# Altium schematic sheet MCU.SchDoc
size A3; DocumentNumber: 6; SheetNumber: 6; SheetTotal: 7
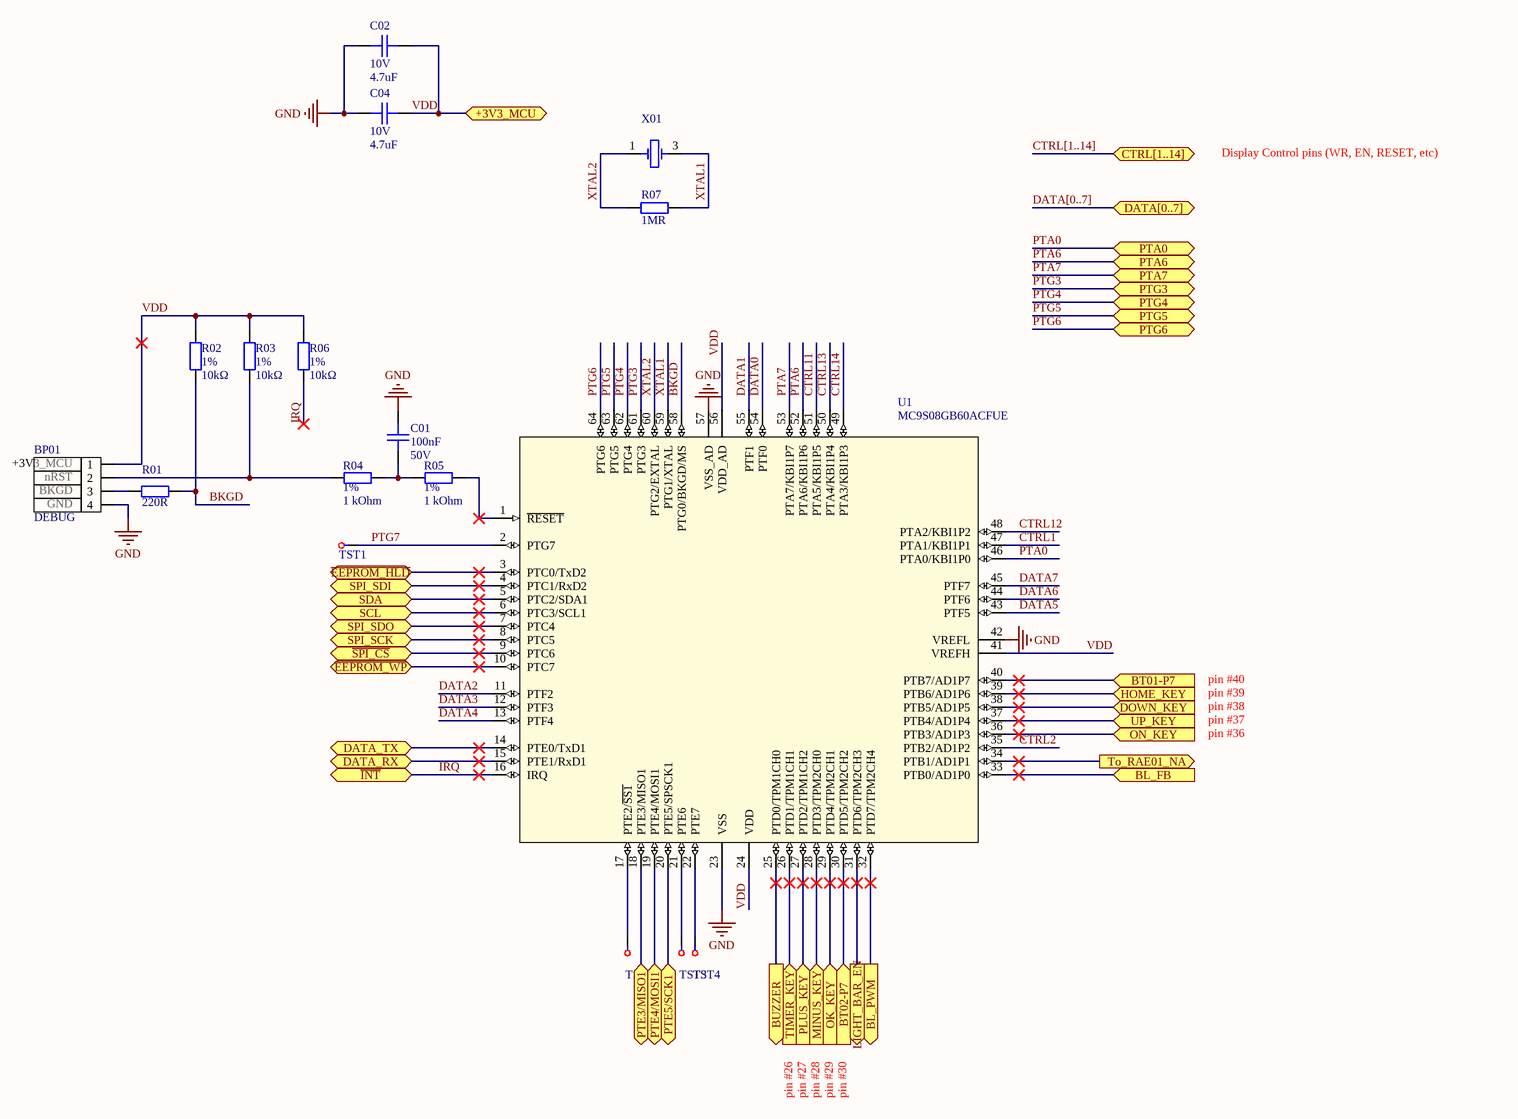
[diagram p0: MCU.SchDoc]

## Parts
BP01  DEBUG  pin_1: +3V3_MCU  pin_2: nRST  pin_3: BKGD  pin_4: GND
C01  Capacitance: 100nF  Voltage Rating: 50V  [CAPC1608X08N_0603]  (hidden comment: CAP CER 0.1uF ±10% 50V X7R 0603)
C02  Voltage Rating: 10V  Capacitance: 4.7uF  [0603C]  (hidden comment: CAP CER 4.7UF 10V X5R 0603)
C04  Voltage Rating: 10V  Capacitance: 4.7uF  [0603C]  (hidden comment: CAP CER 4.7UF 10V X5R 0603)
R01  Resistance: 220R  [Resistor-0603]  (hidden comment: R 220Ω ±1% 0603 0.1W)
R02  Tolerance: 1%  Resistance: 10kΩ  [R0603]  (hidden comment: 10 kOhms ±1% 0.1W, 1/10W Chip Resistor 0603 (1608 Metric)  Thick Film)
R03  Tolerance: 1%  Resistance: 10kΩ  [R0603]  (hidden comment: 10 kOhms ±1% 0.1W, 1/10W Chip Resistor 0603 (1608 Metric)  Thick Film)
R04  Tolerance: 1%  Resistance: 1 kOhm  [R0603]  (hidden comment: 1 kOhms ±1% 0.1W, 1/10W Chip Resistor 0603 (1608 Metric) Moisture Resistant Thick Film)  (no BOM)
R05  Tolerance: 1%  Resistance: 1 kOhm  [R0603]  (hidden comment: 1 kOhms ±1% 0.1W, 1/10W Chip Resistor 0603 (1608 Metric) Moisture Resistant Thick Film)  (no BOM)
R06  Tolerance: 1%  Resistance: 10kΩ  [R0603]  (hidden comment: 10 kOhms ±1% 0.1W, 1/10W Chip Resistor 0603 (1608 Metric)  Thick Film)
R07  Resistance: 1MR  [Resistor-0603]  (hidden comment: Resistor)
TST1  TestPoint  [Testpoint]  (value not drawn)  (no BOM)
TST2  TestPoint  [Testpoint]  (value not drawn)  (no BOM)
TST3  TestPoint  [Testpoint]  (value not drawn)  (no BOM)
TST4  TestPoint  [Testpoint]  (value not drawn)  (no BOM)
U1  MC9S08GB60ACFUE
X01  ABM11-16.000MHZ-D2X-T3  [ABM11]  (value not drawn)

## Ports
+3V3_MCU, BL_FB (in), BL_PWM (out), BT01-P7 (in), BT02-P7 (in), BUZZER (out), CTRL[1..14], DATA[0..7], DATA_RX, DATA_TX, DOWN_KEY (in), HOME_KEY (in), LIGHT_BAR_EN (out), MINUS_KEY (in), OK_KEY (in), ON_KEY (in), PLUS_KEY (in), PTA0 (bidir), PTA6 (bidir), PTA7 (bidir), PTE3/MISO1 (bidir), PTE4/MOSI1 (bidir), PTE5/SCK1 (bidir), PTG3 (bidir), PTG4 (bidir), PTG5 (bidir), PTG6 (bidir), SCL, SDA, SPI_SCK, SPI_SDI, SPI_SDO, TIMER_KEY (in), To_RAE01_NA (out), UP_KEY (in), ~{EEPROM_HLD}, ~{EEPROM_WP}, ~{INT}, ~{SPI_CS}

## Nets
D_GND: X01.2(GND) X01.4(GND)
GND: BP01.4 C01.2 C02.1 C04.1 U1.23(VSS) U1.42(VREFL) U1.57(VSS_AD)
~{EEPROM_HLD}: U1.3(PTC0/TxD2) ; port ~{EEPROM_HLD}
~{EEPROM_WP}: U1.10(PTC7) ; port ~{EEPROM_WP}
~{SPI_CS}: U1.9(PTC6) ; port ~{SPI_CS}
BKGD: R01.2 R02.1 U1.58(PTG0/BKGD/MS)
BL_FB: U1.33(PTB0/AD1P0) ; port BL_FB
BL_PWM: U1.32(PTD7/TPM2CH4) ; port BL_PWM
BT01-P7: U1.40(PTB7/AD1P7) ; port BT01-P7
BT02-P7: U1.30(PTD5/TPM2CH2) ; port BT02-P7
BUZZER: U1.25(PTD0/TPM1CH0) ; port BUZZER
CTRL1: U1.47(PTA1/KBI1P1)
CTRL2: U1.35(PTB2/AD1P2)
CTRL11: U1.51(PTA5/KBI1P5)
CTRL12: U1.48(PTA2/KBI1P2)
CTRL13: U1.50(PTA4/KBI1P4)
CTRL14: U1.49(PTA3/KBI1P3)
DATA0: U1.54(PTF0)
DATA1: U1.55(PTF1)
DATA2: U1.11(PTF2)
DATA3: U1.12(PTF3)
DATA4: U1.13(PTF4)
DATA5: U1.43(PTF5)
DATA6: U1.44(PTF6)
DATA7: U1.45(PTF7)
DATA_RX: U1.15(PTE1/RxD1) ; port DATA_RX
DATA_TX: U1.14(PTE0/TxD1) ; port DATA_TX
DOWN_KEY: U1.38(PTB5/AD1P5) ; port DOWN_KEY
HOME_KEY: U1.39(PTB6/AD1P6) ; port HOME_KEY
IRQ: R06.1 U1.16(IRQ) ; port ~{INT}
LIGHT_BAR_EN: U1.31(PTD6/TPM2CH3) ; port LIGHT_BAR_EN
MINUS_KEY: U1.28(PTD3/TPM2CH0) ; port MINUS_KEY
OK_KEY: U1.29(PTD4/TPM2CH1) ; port OK_KEY
ON_KEY: U1.36(PTB3/AD1P3) ; port ON_KEY
PLUS_KEY: U1.27(PTD2/TPM1CH2) ; port PLUS_KEY
PTA0: U1.46(PTA0/KBI1P0) ; port PTA0
PTA6: U1.52(PTA6/KBI1P6) ; port PTA6
PTA7: U1.53(PTA7/KBI1P7) ; port PTA7
PTE3/MISO1: U1.18(PTE3/MISO1) ; port PTE3/MISO1
PTE4/MOSI1: U1.19(PTE4/MOSI1) ; port PTE4/MOSI1
PTE5/SCK1: U1.20(PTE5/SPSCK1) ; port PTE5/SCK1
PTG3: U1.61(PTG3) ; port PTG3
PTG4: U1.62(PTG4) ; port PTG4
PTG5: U1.63(PTG5) ; port PTG5
PTG6: U1.64(PTG6) ; port PTG6
PTG7: TST1.1 U1.2(PTG7)
SCL: U1.6(PTC3/SCL1) ; port SCL
SDA: U1.5(PTC2/SDA1) ; port SDA
SPI_SCK: U1.8(PTC5) ; port SPI_SCK
SPI_SDI: U1.4(PTC1/RxD2) ; port SPI_SDI
SPI_SDO: U1.7(PTC4) ; port SPI_SDO
TIMER_KEY: U1.26(PTD1/TPM1CH1) ; port TIMER_KEY
To_RAE01_NA: U1.34(PTB1/AD1P1) ; port To_RAE01_NA
UP_KEY: U1.37(PTB4/AD1P4) ; port UP_KEY
VDD: BP01.1 C02.2 C04.2 R02.2 R03.2 R06.2 U1.24(VDD) U1.41(VREFH) U1.56(VDD_AD) ; port +3V3_MCU
XTAL1: R07.2 U1.59(PTG1/XTAL) X01.3(OSC2)
XTAL2: R07.1 U1.60(PTG2/EXTAL) X01.1(OSC1)
NetBP01_2: BP01.2 R03.1 R04.1
NetBP01_3: BP01.3 R01.1
NetC01_1: C01.1 R04.2 R05.1
NetR05_2: R05.2 U1.1(~{RESET})
NetTST2_1: TST2.1 U1.17(PTE2/~{SS1})
NetTST3_1: TST3.1 U1.21(PTE6)
NetTST4_1: TST4.1 U1.22(PTE7)

## Buses and harness runs
bus CTRL[1..14] = port CTRL[1..14]
bus DATA[0..7] = port DATA[0..7]

## Notes on the sheet
- Display Control pins (WR, EN, RESET, etc)
- pin #40
- pin #39
- pin #38
- pin #37
- pin #36
- pin #26
- pin #27
- pin #28
- pin #29
- pin #30
- Title
- Size:
- Date:
- A3
- Number:
- Time:
- Revision:
- Sheet
- of
- File:

## Library data of the parts
BP01 = CONN HEADER 4POS
C01 = CAP CER 0.1uF ±10% 50V X7R 0603: Capacitor; Manufacturer: KEMET; Manufacturer Part Number: C0603C104M5RACTU; Dielectric Material: Ceramic; Tolerance: 20%; Dissipation Factor: 2.5%; Supplier 1: Digi-Key; Stock 1: 1202175; Pricing 1: 1=0.1, 10=0.039, 50=0.0204, 100=0.0174, 500=0.0124, 1000=0.0097 (USD); Mount: Surface Mount,PCB; Case/Package: 0603; Case Code (Metric): 1608; Case Code (Imperial): 0603; Contact Plating: Tin,Matte; Min Operating Temperature: -55°C; Max Operating Temperature: 125°C; Package Quantity: 1; Packaging: Tape and Reel; Voltage Rating (DC): 50V; Dielectric: X7R; Termination: SMD/SMT; Length: 1.6mm; Height: 0.8mm; Width: 0.031inch; Thickness: 0.034inch; Lead Pitch: 0.7mm; Depth: 0.8mm; Radiation Hardening: No; REACH SVHC: No SVHC; ComponentLink1URL: http://www.farnell.com/datasheets/2746056.pdf?src-supplier=Element14; ComponentLink1Description: http://www.farnell.com/datasheets/2746056.pdf?src-supplier=Element14; ComponentLink2URL: http://www.mouser.com/ds/2/212/KEM_C1002_X7R_SMD-1102033.pdf?src-supplier=Mouser; ComponentLink2Description: http://www.mouser.com/ds/2/212/KEM_C1002_X7R_SMD-1102033.pdf?src-supplier=Mouser; ComponentLink3URL: https://www.verical.com/server-webapp/html/getDatasheet?partID=626892&src-supplier=Verical; ComponentLink3Description: https://www.verical.com/server-webapp/html/getDatasheet?partID=626892&src-supplier=Verical; ComponentLink4URL: http://components.arrow.com/part/dataview/40911037S8853915N7429?src-supplier=Arrow; ComponentLink4Description: http://components.arrow.com/part/dataview/40911037S8853915N7429?src-supplier=Arrow; ComponentLink5URL: http://capacitoredge.kemet.com/capedge2/DataSheet?pn=C0603C104M5RAC7867&src-supplier=Avnet; ComponentLink5Description: http://capacitoredge.kemet.com/capedge2/DataSheet?pn=C0603C104M5RAC7867&src-supplier=Avnet; ComponentLink6URL: http://capacitoredge.kemet.com/capedge2/DataSheet?pn=C0603C104M5RAC7867&src-supplier=Avnet+Asia; ComponentLink6Description: http://capacitoredge.kemet.com/capedge2/DataSheet?pn=C0603C104M5RAC7867&src-supplier=Avnet+Asia; ComponentLink7URL: http://www.farnell.com/datasheets/2746056.pdf?src-supplier=Farnell; ComponentLink7Description: http://www.farnell.com/datasheets/2746056.pdf?src-supplier=Farnell; ComponentLink8URL: http://www.farnell.com/datasheets/2746056.pdf?src-supplier=Newark; ComponentLink8Description: http://www.farnell.com/datasheets/2746056.pdf?src-supplier=Newark; ComponentLink9URL: http://www.alliedelec.com/m/d/6f3b5eb83d09db50ed28bdc730567b33.pdf?src-supplier=Allied+Electronics; ComponentLink9Description: http://www.alliedelec.com/m/d/6f3b5eb83d09db50ed28bdc730567b33.pdf?src-supplier=Allied+Electronics; ComponentLink10URL: https://api.kemet.com/component-edge/download/datasheet/C0603C104M5RACTU.pdf?src-supplier=Digi-Key; ComponentLink10Description: https://api.kemet.com/component-edge/download/datasheet/C0603C104M5RACTU.pdf?src-supplier=Digi-Key; ComponentLink11URL: http://www.farnell.com/datasheets/2315113.pdf?src-supplier=Newark; ComponentLink11Description: http://www.farnell.com/datasheets/2315113.pdf?src-supplier=Newark; ComponentLink12URL: http://www.farnell.com/datasheets/1828800.pdf?src-supplier=Newark; ComponentLink12Description: http://www.farnell.com/datasheets/1828800.pdf?src-supplier=Newark; ComponentLink13URL: http://components.arrow.com/part/dataview/0323_00313986?src-supplier=Arrow+Europe; ComponentLink13Description: http://components.arrow.com/part/dataview/0323_00313986?src-supplier=Arrow+Europe; ComponentLink14URL: https://www.verical.com/server-webapp/html/getDatasheet?partID=110138&src-supplier=Verical; ComponentLink14Description: https://www.verical.com/server-webapp/html/getDatasheet?partID=110138&src-supplier=Verical; Supplier Part Number 1: 399-7845-1-ND
C02 C04 = CAP CER 4.7UF 10V X5R 0603: 4.7µF ±10% 10V Ceramic Capacitor X5R 0603 (1608 Metric); Manufacturer: Yageo; Manufacturer Part Number: CC0603KRX5R6BB475; Supplier 1: Digi-Key; Stock 1: 325858; Pricing 1: 1=0.26, 10=0.18, 100=0.102, 500=0.072, 1000=0.063 (USD); Mount: Surface Mount; Case Code (Imperial): 0603; Case Code (Metric): 1608; Min Operating Temperature: -55°C; Max Operating Temperature: 85°C; Voltage Rating (DC): 10V; Tolerance: 10%; Packaging: Tape and Reel; Package Quantity: 1; Dielectric: X5R; Termination: SMD/SMT; Composition: Ceramic; Length: 1.6mm; Height: 0.8mm; Width: 0.8mm; Thickness: 0.035inch; Depth: 0.8mm; Radiation Hardening: No; REACH SVHC: Unknown; Lead Free: Lead Free; Halogen Free: Halogen Free; ComponentLink1URL: http://www.farnell.com/datasheets/2167237.pdf?src-supplier=Element14; ComponentLink1Description: http://www.farnell.com/datasheets/2167237.pdf?src-supplier=Element14; ComponentLink2URL: http://www.yageo.com/documents/recent/UPY-GPHC_X5R_4V-to-50V_25.pdf?src-supplier=Digi-Key; ComponentLink2Description: http://www.yageo.com/documents/recent/UPY-GPHC_X5R_4V-to-50V_25.pdf?src-supplier=Digi-Key; ComponentLink3URL: http://www.yageo.com/documents/recent/UPY-GPHC_X5R_4V-to-50V_12.pdf?src-supplier=Avnet; ComponentLink3Description: http://www.yageo.com/documents/recent/UPY-GPHC_X5R_4V-to-50V_12.pdf?src-supplier=Avnet; ComponentLink4URL: http://www.yageo.com/documents/recent/UPY-GPHC_X5R_4V-to-50V_12.pdf?src-supplier=Avnet+Europe; ComponentLink4Description: http://www.yageo.com/documents/recent/UPY-GPHC_X5R_4V-to-50V_12.pdf?src-supplier=Avnet+Europe; Supplier Part Number 1: 311-1455-1-ND; Case/Package: 0603
R01 = R 220Ω ±1% 0603 0.1W: Resistor; Manufacturer: Stackpole Electronics; Manufacturer Part Number: RMCF0603FT220R; Power Rating: 100mW; Temperature Coefficient: 100ppm/°C; Supplier 1: Digi-Key; Stock 1: 79747; Pricing 1: 1=0.1, 10=0.016, 100=0.0065, 1000=0.0029, 2500=0.0025 (USD); Mount: Surface Mount; Case/Package: 0603; Case Code (Metric): 1608; Case Code (Imperial): 0603; Contact Plating: Tin,Matte; Min Operating Temperature: -55°C; Max Operating Temperature: 155°C; Packaging: Tape and Reel; Composition: Thick Film; Number of Terminations: 2; Max Power Dissipation: 100mW; Features: Automotive AEC-Q200; Length: 0.061inch; Height: 0.022inch; Width: 0.031inch; Radiation Hardening: No; Lead Free: Lead Free; ComponentLink1URL: http://components.arrow.com/part/dataview/50498833S229663N1174?src-supplier=Arrow; ComponentLink1Description: http://components.arrow.com/part/dataview/50498833S229663N1174?src-supplier=Arrow; ComponentLink2URL: https://www.seielect.com/catalog/SEI-Packaging.pdf?src-supplier=Digi-Key; ComponentLink2Description: https://www.seielect.com/catalog/SEI-Packaging.pdf?src-supplier=Digi-Key; ComponentLink3URL: http://www.seielect.com/Catalog/SEI-RMC.pdf?src-supplier=Future+Electronics; ComponentLink3Description: http://www.seielect.com/Catalog/SEI-RMC.pdf?src-supplier=Future+Electronics; ComponentLink4URL: https://www.seielect.com/catalog/SEI-RMCF_RMCP.pdf?src-supplier=Avnet; ComponentLink4Description: https://www.seielect.com/catalog/SEI-RMCF_RMCP.pdf?src-supplier=Avnet; Supplier Part Number 1: RMCF0603FT220RCT-ND; Tolerance: 1%
R02 R03 R06 = RES SMD 10K OHM 1% 1/10W 0603: Manufacturer: Yageo; Manufacturer Part Number: RC0603FR-0710KL; Temperature Coefficient: 100ppm/°C; Power Rating: 100mW; Voltage Rating: 75V; Voltage Rating (DC): 50V; Supplier 1: Digi-Key; Stock 1: 81498627; Pricing 1: 1=0.1, 10=0.024, 100=0.0097, 1000=0.0044, 2500=0.0038 (USD); Case Code (Imperial): 0603; Case Code (Metric): 1608; Min Operating Temperature: -55°C; Max Operating Temperature: 155°C; Composition: Thick Film; Packaging: Tape and Reel; Termination: SMD/SMT; Military Standard: Not; Length: 1.6mm; Height: 0.45mm; Depth: 0.8mm; REACH SVHC: No SVHC; Lead Free: Lead Free; ComponentLink1URL: http://www.farnell.com/datasheets/38590.pdf?src-supplier=Element14; ComponentLink1Description: http://www.farnell.com/datasheets/38590.pdf?src-supplier=Element14; ComponentLink2URL: https://www.verical.com/server-webapp/html/getDatasheet?partID=409289&src-supplier=Verical; ComponentLink2Description: https://www.verical.com/server-webapp/html/getDatasheet?partID=409289&src-supplier=Verical; ComponentLink3URL: http://www.farnell.com/datasheets/1868787.pdf?src-supplier=Element14; ComponentLink3Description: http://www.farnell.com/datasheets/1868787.pdf?src-supplier=Element14; ComponentLink4URL: http://www.farnell.com/datasheets/2167052.pdf?src-supplier=Element14; ComponentLink4Description: http://www.farnell.com/datasheets/2167052.pdf?src-supplier=Element14; ComponentLink5URL: http://www.farnell.com/datasheets/443971.pdf?src-supplier=Element14; ComponentLink5Description: http://www.farnell.com/datasheets/443971.pdf?src-supplier=Element14; Supplier Part Number 1: 311-10.0KHRCT-ND; Case/Package: 0603; Number of Pins: 2; Weight: 7.1E-05oz; Width: 0.8mm; Lead Pitch: 0.3mm
R04 R05 = RES SMD 1K OHM 1% 1/10W 0603: Manufacturer: Yageo; Manufacturer Part Number: RC0603FR-071KL; Temperature Coefficient: 100ppm/°C; Power Rating: 100mW; Voltage Rating: 50V; Supplier 1: Digi-Key; Stock 1: 39344753; Pricing 1: 1=0.1, 10=0.023, 100=0.0094, 1000=0.0042, 2500=0.0037 (USD); Contact Plating: Tin,Matte; Case Code (Imperial): 0603; Case Code (Metric): 1608; Min Operating Temperature: -55°C; Max Operating Temperature: 155°C; Composition: Thick Film; Packaging: Tape and Reel; Termination: SMD/SMT; Military Standard: Not; Length: 1.6mm; Height: 0.45mm; Depth: 0.8mm; Radiation Hardening: No; REACH SVHC: No SVHC; Lead Free: Lead Free; ComponentLink1URL: http://documents.rs-components.com/techlib://itc_doclist_GB.htm?stockno=5048928&src-supplier=RSComponents; ComponentLink1Description: http://documents.rs-components.com/techlib://itc_doclist_GB.htm?stockno=5048928&src-supplier=RSComponents; ComponentLink2URL: http://www.yageo.com/documents/recent/PYu-RC0603_51_RoHS_L_4.pdf?src-supplier=Avnet+Europe; ComponentLink2Description: http://www.yageo.com/documents/recent/PYu-RC0603_51_RoHS_L_4.pdf?src-supplier=Avnet+Europe; ComponentLink3URL: http://www.farnell.com/datasheets/2167052.pdf?src-supplier=Element14; ComponentLink3Description: http://www.farnell.com/datasheets/2167052.pdf?src-supplier=Element14; ComponentLink4URL: http://www.farnell.com/datasheets/1868787.pdf?src-supplier=Element14; ComponentLink4Description: http://www.farnell.com/datasheets/1868787.pdf?src-supplier=Element14; ComponentLink5URL: http://www.yageo.com/documents/recent/PYu-RC_Group_51_RoHS_L_2.pdf?src-supplier=Avnet; ComponentLink5Description: http://www.yageo.com/documents/recent/PYu-RC_Group_51_RoHS_L_2.pdf?src-supplier=Avnet; ComponentLink6URL: https://www.verical.com/server-webapp/html/getDatasheet?partID=404327&src-supplier=Verical; ComponentLink6Description: https://www.verical.com/server-webapp/html/getDatasheet?partID=404327&src-supplier=Verical; ComponentLink7URL: http://www.farnell.com/datasheets/443971.pdf?src-supplier=Element14; ComponentLink7Description: http://www.farnell.com/datasheets/443971.pdf?src-supplier=Element14; Supplier Part Number 1: 311-1.00KHRDKR-ND; Case/Package: 0603
R07 = R 1MΩ ±5% 0603 0.1W: Manufacturer: Stackpole Electronics; Manufacturer Part Number: RMCF0603FG1M00; Temperature Coefficient: 100ppm/°C; Tolerance: 1%; Max Power Dissipation: 100mW; Supplier 1: Digi-Key; Stock 1: 429298; Pricing 1: 1=0.1, 10=0.016, 100=0.0065, 1000=0.0029, 2500=0.0025, 5000=0.0021 (USD); Contact Plating: Tin,Matte; Case Code (Imperial): 0603; Case Code (Metric): 1608; Min Operating Temperature: -55°C; Max Operating Temperature: 155°C; Composition: Thick Film; Packaging: Tape and Reel; Length: 0.061inch; Height: 0.022inch; Radiation Hardening: No; Lead Free: Contains Lead; ComponentLink1URL: https://www.seielect.com/catalog/SEI-Packaging.pdf?src-supplier=Digi-Key; ComponentLink1Description: https://www.seielect.com/catalog/SEI-Packaging.pdf?src-supplier=Digi-Key; ComponentLink2URL: https://www.seielect.com/catalog/SEI-RMCF_RMCP.pdf?src-supplier=Avnet; ComponentLink2Description: https://www.seielect.com/catalog/SEI-RMCF_RMCP.pdf?src-supplier=Avnet; ComponentLink3URL: https://www.seielect.com/Catalog/SEI-RMCF_RMCP.pdf?src-supplier=Digi-Key; ComponentLink3Description: https://www.seielect.com/Catalog/SEI-RMCF_RMCP.pdf?src-supplier=Digi-Key; Supplier Part Number 1: RMCF0603FG1M00CT-ND; Case/Package: 0603; Mount: Surface Mount; Package Quantity: 1; Number of Terminations: 2; Features: Automotive AEC-Q200; Width: 0.031inch
TST1-TST4 = TestPoint: Test Point. There is nothing to buy or mount.; ClassName: TestPoint; CompType: TestPoint; Manufacturer: N/A; MountType: N/A; PackageReference: TetsPoint; PartNumber: N/A
U1 = IC MC9S08GB60ACFUE MCU 8BIT 60KB FLASH 64LQFP: Manufacturer: NXP Freescale; RAM Size: 4KB; Frequency: 40MHz; Memory Size: 60KB; Number of Bits: 8; Core Architecture: S08; Interface: I2C,SPI,SCI; Number of I/Os: 56; Max Supply Voltage: 3.6V; Min Supply Voltage: 1.8V; Data Bus Width: 8b; Oscillator Type: Internal; Memory Type: FLASH; Watchdog Timer: Yes; Peripherals: PWM,I2C,POR,WDT,LVD; Operating Supply Voltage: 3.3V; Number of UART Channels: 2; Number of SPI Channels: 1; Supplier 1: Digi-Key; Manufacturer Part Number: MC9S08GB60ACFUE; Stock 1: 0; Pricing 1: 1=16.16, 10=16.002 (USD); Mount: Surface Mount; Case/Package: LQFP; Number of Pins: 64; Contact Plating: Tin,Matte; Min Operating Temperature: -40°C; Max Operating Temperature: 85°C; Packaging: Tray; Density: 60KB; Number of Timers/Counters: 8; Number of Programmable I/O: 56; Max Frequency: 40MHz; Package Quantity: 160; Number of PWM Channels: 8; Number of ADC Channels: 8; Number of I2C Channels: 1; Termination: SMD/SMT; Length: 10mm; Width: 10mm; Height: 1.4mm; Radiation Hardening: No; REACH SVHC: No SVHC; RoHS Compliant: Yes; ComponentLink1URL: http://www.jameco.com/Jameco/Products/ProdDS/1035379.pdf?src-supplier=Jameco; ComponentLink1Description: http://www.jameco.com/Jameco/Products/ProdDS/1035379.pdf?src-supplier=Jameco; ComponentLink2URL: http://www.farnell.com/datasheets/1844091.pdf?src-supplier=Element14; ComponentLink2Description: http://www.farnell.com/datasheets/1844091.pdf?src-supplier=Element14; ComponentLink3URL: http://www.farnell.com/datasheets/72141.pdf?src-supplier=Farnell; ComponentLink3Description: http://www.farnell.com/datasheets/72141.pdf?src-supplier=Farnell; ComponentLink4URL: http://www.freescale.com/files/microcontrollers/doc/data_sheet/MC9S08GB60A.pdf?src-supplier=Future+Electronics; ComponentLink4Description: http://www.freescale.com/files/microcontrollers/doc/data_sheet/MC9S08GB60A.pdf?src-supplier=Future+Electronics; ComponentLink5URL: http://www.produktinfo.conrad.com/datenblaetter/1100000-1199999/001183148-da-01-en-IC_MCU_60K_F_MC9S08GB60ACFUE_LQFP_64_FRE.pdf?src-supplier=Conrad; ComponentLink5Description: http://www.produktinfo.conrad.com/datenblaetter/1100000-1199999/001183148-da-01-en-IC_MCU_60K_F_MC9S08GB60ACFUE_LQFP_64_FRE.pdf?src-supplier=Conrad; ComponentLink6URL: http://datasheet.iiic.cc/freescale_semiconductor/MC9S08GB60ACFUE.pdf?src-supplier=IIIC; ComponentLink6Description: http://datasheet.iiic.cc/freescale_semiconductor/MC9S08GB60ACFUE.pdf?src-supplier=IIIC; Supplier Part Number 1: MC9S08GB60ACFUE-ND
X01 = CRYSTAL_16.0000MHZ_10PF_SMD: 16MHz ±20ppm 10pF 150 Ohms 4-SMD; Manufacturer: Abracon LLC; Digi-KeyPartNumber: 535-12629-1-ND; PartNumber: ABM11-16.000MHZ-D2X-T3; Link: https://www.digikey.com/products/en?keywords=535-12629-1-ND